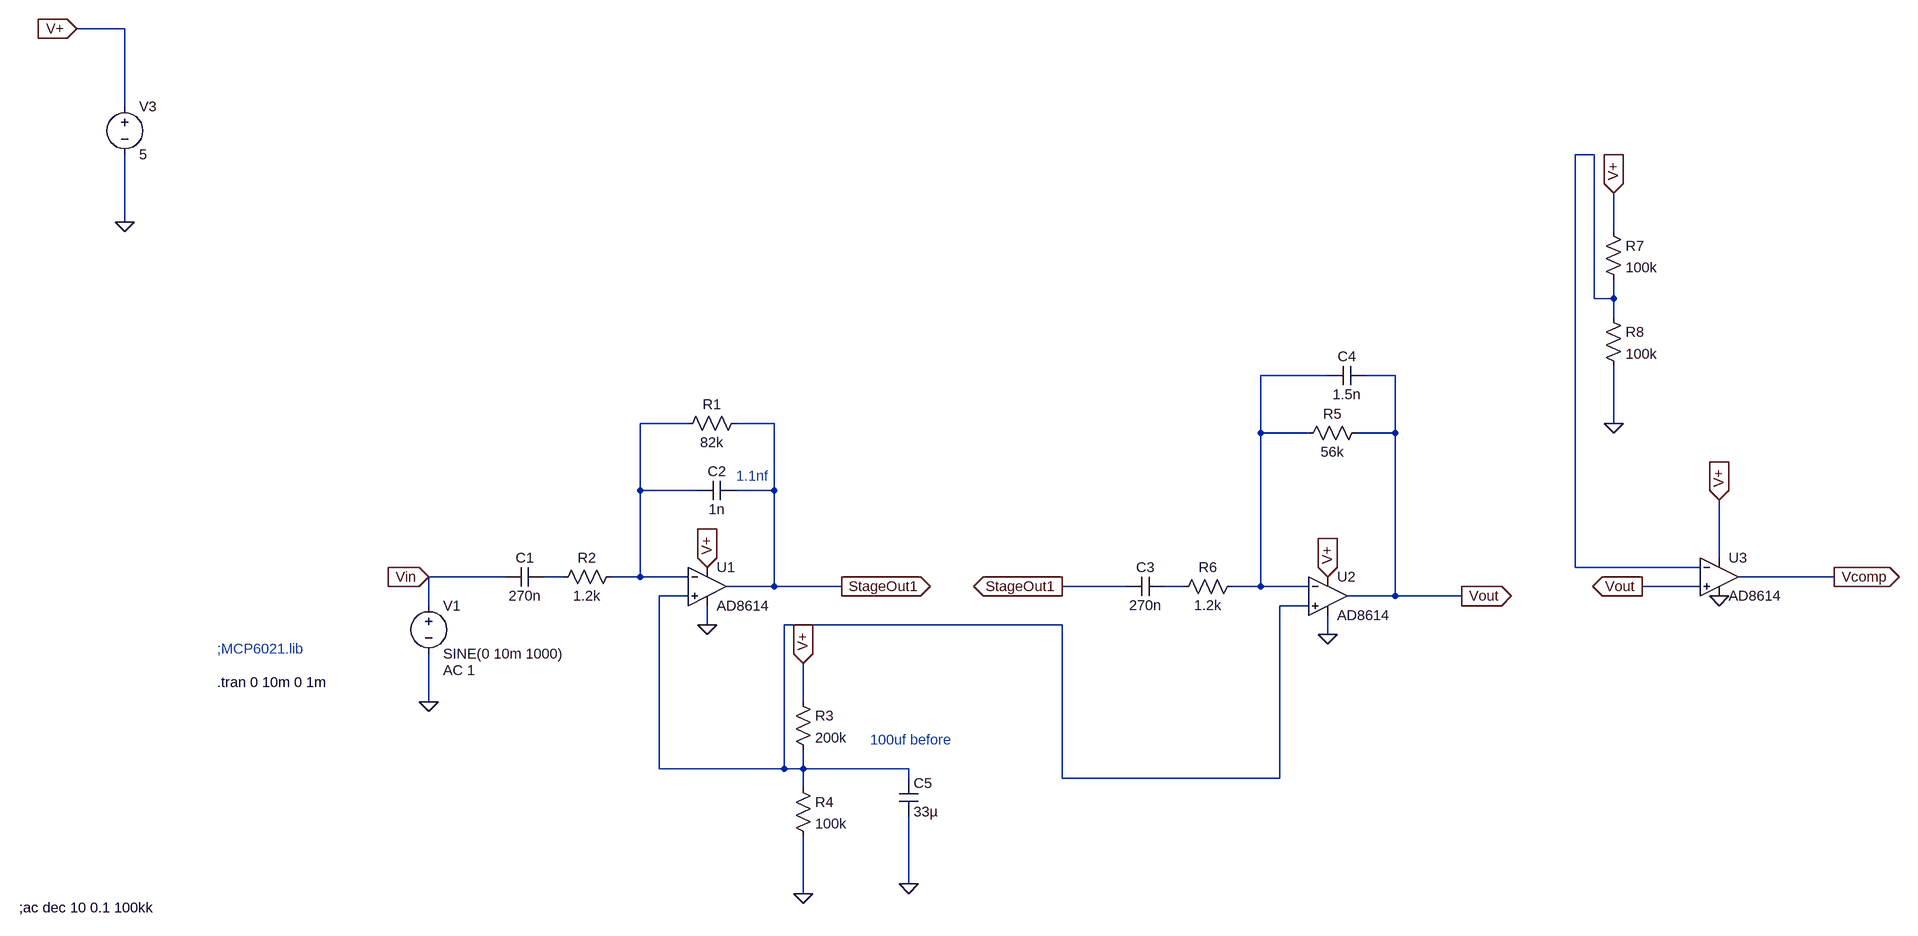
[diagram p0: schematic Active Band Pass Filter.asc]
Active Band Pass Filter.asc, the LTspice schematic file:
Version 4
SHEET 1 4040 680
WIRE -192 -960 -272 -960
WIRE -192 -800 -192 -960
WIRE 3504 -720 3472 -720
WIRE -192 -608 -192 -720
WIRE 3536 -592 3536 -656
WIRE 3504 -480 3504 -720
WIRE 3536 -480 3536 -512
WIRE 3536 -480 3504 -480
WIRE 3536 -448 3536 -480
WIRE 2928 -352 2816 -352
WIRE 3040 -352 2992 -352
WIRE 1840 -272 1760 -272
WIRE 1984 -272 1920 -272
WIRE 3536 -272 3536 -368
WIRE 2816 -256 2816 -352
WIRE 2896 -256 2816 -256
WIRE 3040 -256 3040 -352
WIRE 3040 -256 2976 -256
WIRE 1760 -160 1760 -272
WIRE 1856 -160 1760 -160
WIRE 1984 -160 1984 -272
WIRE 1984 -160 1920 -160
WIRE 3712 -48 3712 -144
WIRE 3472 -32 3472 -720
WIRE 3680 -32 3472 -32
WIRE 1536 -16 1408 -16
WIRE 1632 -16 1600 -16
WIRE 1760 -16 1760 -160
WIRE 1760 -16 1712 -16
WIRE 1840 -16 1760 -16
WIRE 3904 -16 3744 -16
WIRE 1984 0 1984 -160
WIRE 1984 0 1904 0
WIRE 2096 0 1984 0
WIRE 2592 0 2464 0
WIRE 2688 0 2656 0
WIRE 2816 0 2816 -256
WIRE 2816 0 2768 0
WIRE 2896 0 2816 0
WIRE 3680 0 3584 0
WIRE 1840 16 1792 16
WIRE 3040 16 3040 -256
WIRE 3040 16 2960 16
WIRE 3216 16 3040 16
WIRE 1408 32 1408 -16
WIRE 2896 32 2848 32
WIRE 1872 64 1872 32
WIRE 2464 64 2000 64
WIRE 2928 80 2928 48
WIRE 1408 192 1408 112
WIRE 2032 192 2032 128
WIRE 1792 304 1792 16
WIRE 2000 304 2000 64
WIRE 2000 304 1792 304
WIRE 2032 304 2032 272
WIRE 2032 304 2000 304
WIRE 2208 304 2032 304
WIRE 2208 320 2208 304
WIRE 2464 320 2464 64
WIRE 2848 320 2848 32
WIRE 2848 320 2464 320
WIRE 2032 336 2032 304
WIRE 2208 496 2208 384
WIRE 2032 512 2032 416
FLAG -192 -608 0
FLAG -272 -960 V+
IOPIN -272 -960 In
FLAG 1872 64 0
FLAG 1872 -32 V+
IOPIN 1872 -32 In
FLAG 2032 512 0
FLAG 1408 192 0
FLAG 1408 -16 Vin
IOPIN 1408 -16 In
FLAG 2096 0 StageOut1
IOPIN 2096 0 Out
FLAG 2928 80 0
FLAG 2928 -16 V+
IOPIN 2928 -16 In
FLAG 2464 0 StageOut1
IOPIN 2464 0 Out
FLAG 3216 16 Vout
IOPIN 3216 16 Out
FLAG 2208 496 0
FLAG 3712 -144 V+
IOPIN 3712 -144 In
FLAG 3712 16 0
FLAG 2032 128 V+
IOPIN 2032 128 In
FLAG 3536 -272 0
FLAG 3536 -656 V+
IOPIN 3536 -656 In
FLAG 3904 -16 Vcomp
IOPIN 3904 -16 Out
FLAG 3584 0 Vout
IOPIN 3584 0 Out
SYMBOL voltage -192 -816 R0
WINDOW 123 0 0 Left 0
WINDOW 39 0 0 Left 0
SYMATTR InstName V3
SYMATTR Value 5
SYMBOL res 1936 -288 R90
WINDOW 0 0 56 VBottom 2
WINDOW 3 32 56 VTop 2
SYMATTR InstName R1
SYMATTR Value 82k
SYMBOL res 1728 -32 R90
WINDOW 0 0 56 VBottom 2
WINDOW 3 32 56 VTop 2
SYMATTR InstName R2
SYMATTR Value 1.2k
SYMBOL res 2016 176 R0
SYMATTR InstName R3
SYMATTR Value 200k
SYMBOL res 2016 320 R0
SYMATTR InstName R4
SYMATTR Value 100k
SYMBOL voltage 1408 16 R0
WINDOW 123 24 124 Left 2
WINDOW 39 0 0 Left 0
SYMATTR Value2 AC 1
SYMATTR InstName V1
SYMATTR Value SINE(0 10m 1000)
SYMBOL Opamps\\AD8614 1872 -64 R0
SYMATTR InstName U1
SYMBOL cap 1600 -32 R90
WINDOW 0 0 32 VBottom 2
WINDOW 3 32 32 VTop 2
SYMATTR InstName C1
SYMATTR Value 270n
SYMBOL cap 1920 -176 R90
WINDOW 0 0 32 VBottom 2
WINDOW 3 32 32 VTop 2
SYMATTR InstName C2
SYMATTR Value 1n
SYMBOL res 2992 -272 R90
WINDOW 0 0 56 VBottom 2
WINDOW 3 32 56 VTop 2
SYMATTR InstName R5
SYMATTR Value 56k
SYMBOL res 2784 -16 R90
WINDOW 0 0 56 VBottom 2
WINDOW 3 32 56 VTop 2
SYMATTR InstName R6
SYMATTR Value 1.2k
SYMBOL Opamps\\AD8614 2928 -48 R0
SYMATTR InstName U2
SYMBOL cap 2656 -16 R90
WINDOW 0 0 32 VBottom 2
WINDOW 3 32 32 VTop 2
SYMATTR InstName C3
SYMATTR Value 270n
SYMBOL cap 2992 -368 R90
WINDOW 0 0 32 VBottom 2
WINDOW 3 32 32 VTop 2
SYMATTR InstName C4
SYMATTR Value 1.5n
SYMBOL cap 2192 320 R0
SYMATTR InstName C5
SYMATTR Value 33µ
SYMBOL Opamps\\AD8614 3712 -80 R0
SYMATTR InstName U3
SYMBOL res 3520 -608 R0
SYMATTR InstName R7
SYMATTR Value 100k
SYMBOL res 3520 -464 R0
SYMATTR InstName R8
SYMATTR Value 100k
TEXT 960 160 Left 2 !.tran 0 10m 0 1m
TEXT 960 104 Left 2 ;;MCP6021.lib
TEXT -368 536 Left 2 !;ac dec 10 0.1 100kk
TEXT 2144 256 Left 2 ;100uf before
TEXT 1920 -184 Left 2 ;1.1nf

The netlist it stands for:
* Active Band Pass Filter.asc
V3 V+ 0 5
R1 StageOut1 N003 82k
R2 N003 N004 1.2k
R3 V+ N006 200k
R4 N006 0 100k
V1 Vin 0 SINE(0 10m 1000) AC 1
XU1 N006 N003 V+ 0 StageOut1 AD8614  ; pins In+ In- V+ V- OUT
C1 N004 Vin 270n
C2 StageOut1 N003 1n
R5 Vout N002 56k
R6 N002 N005 1.2k
XU2 N006 N002 V+ 0 Vout AD8614  ; pins In+ In- V+ V- OUT
C3 N005 StageOut1 270n
C4 Vout N002 1.5n
C5 N006 0 33µ
XU3 Vout N001 V+ 0 Vcomp AD8614  ; pins In+ In- V+ V- OUT
R7 V+ N001 100k
R8 N001 0 100k
.tran 0 10m 0 1m
* ;MCP6021.lib
;ac dec 10 0.1 100kk
* 100uf before
* 1.1nf
.backanno
.end